# EAGLE design NullAnalyser (EAGLE 7.4.0)
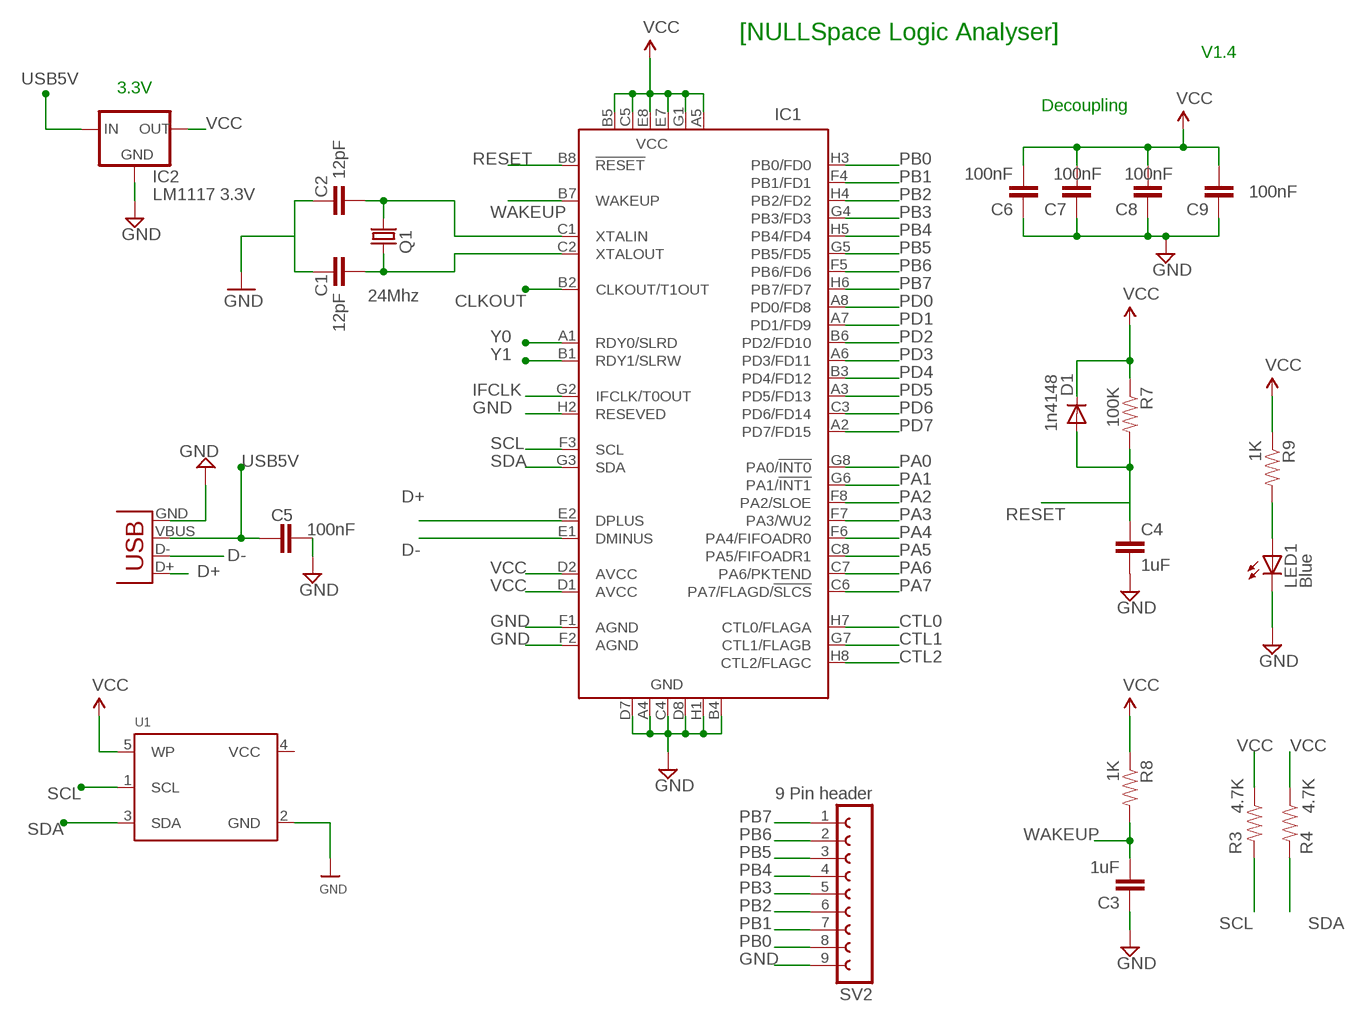
[diagram p0: schematic, sheet 1]

## Parts
C1  12pF  CAP0402-CAP  [0402-CAP]
C2  12pF  CAP0402-CAP  [0402-CAP]
C3  1uF  CAP0402-CAP  [0402-CAP]
C4  1uF  CAP0402-CAP  [0402-CAP]
C5  100nF  CAP0402-CAP  [0402-CAP]
C6  100nF  CAP0402-CAP  [0402-CAP]
C7  100nF  CAP0402-CAP  [0402-CAP]
C8  100nF  CAP0402-CAP  [0402-CAP]
C9  100nF  CAP0402-CAP  [0402-CAP]
D1  1n4148  DIODESOD  [SOD-323]
IC1  CY7C68014A-56BAXC  [VFBGA56]
IC2  LM1117 3.3V  LM1117  [SOT223]
LED1  Blue  LED0603  [LED-0603]
Q1  24Mhz  CRYSTALTWO-PADTWO-PAD  [CRYSTAL-SMD-TWO-PAD]
R3  4.7K  RESISTOR0402-RES  [0402-RES]
R4  4.7K  RESISTOR0402-RES  [0402-RES]
R7  100K  RESISTOR0402-RES  [0402-RES]
R8  1K  RESISTOR0402-RES  [0402-RES]
R9  1K  RESISTOR0402-RES  [0402-RES]
SV2  9 Pin header  FE09-1  [FE09]
U1  MCP24AA32  [SOT23-5]
X1  USB-MICROB  [USB-MICROB]

## Nets
CLKOUT: IC1.B2(CLKOUT/T1OUT)
CTL0: IC1.H7(CTL0/FLAGA)
CTL1: IC1.G7(CTL1/FLAGB)
CTL2: IC1.H8(CTL2/FLAGC)
D+: IC1.E2(DPLUS) X1.D+
D-: IC1.E1(DMINUS) X1.D-
GND: C1.1 C2.2 C3.1 C4.2 C5.2 C6.1 C7.1 C8.1 C9.1 IC1.A4(GND) IC1.B4(GND) IC1.C4(GND) IC1.D7(GND) IC1.D8(GND) IC1.F1(AGND) IC1.F2(AGND) IC1.H1(GND) IC1.H2(RESEVED) IC2.1(GND) LED1.C SV2.9 U1.2(GND) X1.GND
IFCLK: IC1.G2(IFCLK/T0OUT)
N$2: LED1.A R9.2
N$10: C2.1 IC1.C1(XTALIN) Q1.2
N$11: C1.2 IC1.C2(XTALOUT) Q1.1
PA0: IC1.G8(PA0/!INT0)
PA1: IC1.G6(PA1/!INT1)
PA2: IC1.F8(PA2/SLOE)
PA3: IC1.F7(PA3/WU2)
PA4: IC1.F6(PA4/FIFOADR0)
PA5: IC1.C8(PA5/FIFOADR1)
PA6: IC1.C7(PA6/PKTEND)
PA7: IC1.C6(PA7/FLAGD/!SLCS)
PB0: IC1.H3(PB0/FD0) SV2.8
PB1: IC1.F4(PB1/FD1) SV2.7
PB2: IC1.H4(PB2/FD2) SV2.6
PB3: IC1.G4(PB3/FD3) SV2.5
PB4: IC1.H5(PB4/FD4) SV2.4
PB5: IC1.G5(PB5/FD5) SV2.3
PB6: IC1.F5(PB6/FD6) SV2.2
PB7: IC1.H6(PB7/FD7) SV2.1
PD0: IC1.A8(PD0/FD8)
PD1: IC1.A7(PD1/FD9)
PD2: IC1.B6(PD2/FD10)
PD3: IC1.A6(PD3/FD11)
PD4: IC1.B3(PD4/FD12)
PD5: IC1.A3(PD5/FD13)
PD6: IC1.C3(PD6/FD14)
PD7: IC1.A2(PD7/FD15)
RESET: C4.1 D1.2(A) IC1.B8(!RESET) R7.2
SCL: IC1.F3(SCL) R3.2 U1.1(SCL)
SDA: IC1.G3(SDA) R4.2 U1.3(SDA)
USB5V: C5.1 IC2.3(IN) X1.VBUS
VCC [power]: C6.2 C7.2 C8.2 C9.2 D1.1(C) IC1.A5(VCC) IC1.B5(VCC) IC1.C5(VCC) IC1.D1(AVCC) IC1.D2(AVCC) IC1.E7(VCC) IC1.E8(VCC) IC1.G1(VCC) IC2.2(OUT) R3.1 R4.1 R7.1 R8.1 R9.1 U1.5(WP)
WAKEUP: C3.2 IC1.B7(WAKEUP) R8.2
Y0: IC1.A1(RDY0/SLRD)
Y1: IC1.B1(RDY1/SLRW)
Unconnected: U1.4(VCC)

## Notes on the sheet
- [NULLSpace Logic Analyser]
- V1.4
- 3.3V
- Decoupling

## Library data of the parts
C1 C2 = SparkFun:CAP: Capacitor Standard 0603 ceramic capacitor, and 0.1" leaded capacitor.; MF: KEMET; MPN: C0805C120J5GACTU; OC_NEWARK: 64K2898
C3 C4 = SparkFun:CAP: Capacitor Standard 0603 ceramic capacitor, and 0.1" leaded capacitor.; MPN: C2012Y5V1C105Z/0.85; OC_NEWARK: 90R7762
C5-C9 = SparkFun:CAP: Capacitor Standard 0603 ceramic capacitor, and 0.1" leaded capacitor.; MF: FARNELL; MPN: GRM21BR71H104KA01L; OC_NEWARK: 38K1694
D1 = SparkFun:DIODE: Diode These are standard reverse protection diodes and small signal diodes. SMA package can handle up to about 1A. SOD-323 can handle about 200mA. What the SOD-323 package when ordering, there are some mfgs out there that are 5-pin packages.; MF: VISHAY/TELEFUNKEN; MPN: 1N4148W-V-GS08; OC_NEWARK: 35K9698
IC1 = cypress:CY7C6801*A-56: EZ-USB FX2LP (TM) USB Microcontroller Source: http://www.cypress.com .. cy7c68013a_5.pdf; MPN: CY7C68014A-56BAXC; OC_FARNELL: 1269138; OC_NEWARK: 23M5564
IC2 = v-reg-3:LM1117; MF: NATIONAL SEMICONDUCTOR; MPN: LM1117MPX-3.3; OC_NEWARK: 13B5343
LED1 = SparkFun:LED: LEDs Standard schematic elements and footprints for 5mm, 3mm, 1206, and 0603 sized LEDs. 5mm - Spark Fun Electronics SKU : COM-00529 (and others); MPN: 5988210107F; OC_NEWARK: 75R0591
Q1 = NullAnalyser:CRYSTAL: Crystals Various standard crystals. Proven footprints. Spark Fun Electronics SKU : COM-00534; MF: Abracon Corporation; MPN: ABM3-24.000MHZ-B2-T; OC_NEWARK: 13J1723
R3 R4 = SparkFun:RESISTOR: Resistor Basic schematic elements and footprints for 0603, 1206, and PTH 1/10th watt (small) resistors.; MPN: CRCW08054K70JNEA; OC_NEWARK: 59M6911
R7 = SparkFun:RESISTOR: Resistor Basic schematic elements and footprints for 0603, 1206, and PTH 1/10th watt (small) resistors.; MPN: MCTF0805DTC1002; OC_NEWARK: 01P2111
R8 R9 = SparkFun:RESISTOR: Resistor Basic schematic elements and footprints for 0603, 1206, and PTH 1/10th watt (small) resistors.; MPN: MCTF0805DTC1001; OC_NEWARK: 01P2109
SV2 = con-lsta:FE09-1: FEMALE HEADER; OC_FARNELL: unknown; OC_NEWARK: unknown
U1 = microbuilder:MCP24AA32: Microchip 32K (4K x 8) 1.8V I2C EEPROM SOT23-5 [Digikey: 24AA32AFT-I/OTCT-ND]; MF: MICROCHIP; MPN: 24LC00T-I/OT; OC_NEWARK: 62K0574
X1 = SparkFun:USB: USB Connectors USB-B-PTH is fully proven SKU : PRT-00139 USB-miniB is fully proven SKU : PRT-00587 USB-A-PCB is untested. USB-A-H is throughly reviewed, but untested. Spark Fun Electronics SKU : PRT-00437 USB-B-SMT is throughly reviewed, but untested. Needs silkscreen touching up. USB-A-S has not been used/tested USB-MB-H has not been used/tested; MPN: 1734035-1; OC_NEWARK: 16M2760

## Net classes
0 default: width 0.051 mm
1 power: width 0.051 mm

## Board
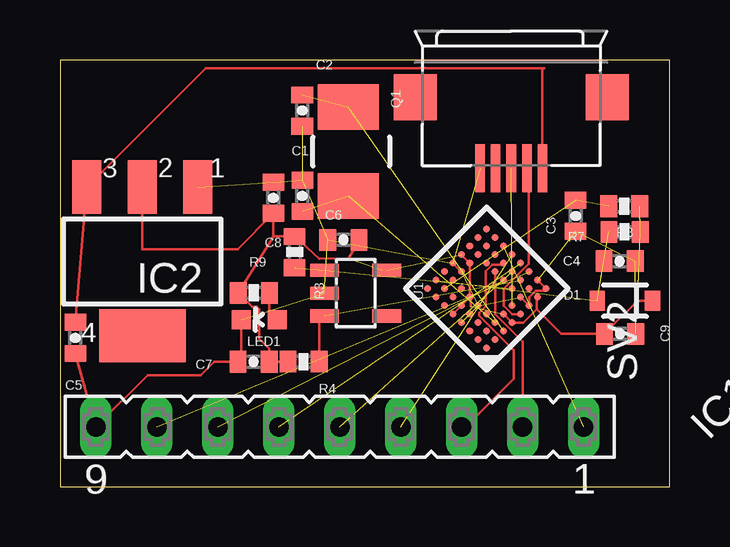
[diagram p1: board, top side]

Size 25.4 x 17.78 mm. Coordinates in mm from the lower left corner, seen from the top.
Outline: 0,0 25.4,0 25.4,17.78 0,17.78 0,0
Copper layers (1*2*16): Top 0.0356mm / dielectric 1.5011mm / Route2 0.0356mm / dielectric 0.1499mm / Bottom 0.0356mm
Design rules "SilverCircuits *": minimum track width 4mil, minimum drill 10mil, track to track 7mil, track to pad 7mil, pad to pad 7mil, via to via 7mil, smd to smd 0mil, copper to edge 20mil, drill to drill 8mil, minimum pad ring 10mil, minimum via ring 8mil, stop-mask expansion 4mil, vias tented up to drill 0mil, thermal gap 10mil
Milling: 1 lines

### Footprints (pad centres in the part's own frame; a part is rotated, then mirrored left to right if it is on the bottom)
0402-CAP = smd 0.7 x 0.9: 1 -0.65,0; 2 0.65,0
SOD-323 = smd 0.63 x 0.83: 1 -1.15,0; 2 1.15,0
VFBGA56 = smd 0.3 x 0.3: A1 -1.75,1.75; A2 -1.25,1.75; A3 -0.75,1.75; A4 -0.25,1.75; A5 0.25,1.75; A6 0.75,1.75; A7 1.25,1.75; A8 1.75,1.75; B1 -1.75,1.25; B2 -1.25,1.25; B3 -0.75,1.25; B4 -0.25,1.25; B5 0.25,1.25; B6 0.75,1.25; B7 1.25,1.25; B8 1.75,1.25; C1 -1.75,0.75; C2 -1.25,0.75; C3 -0.75,0.75; C4 -0.25,0.75; C5 0.25,0.75; C6 0.75,0.75; C7 1.25,0.75; C8 1.75,0.75; D1 -1.75,0.25; D2 -1.25,0.25; D7 1.25,0.25; D8 1.75,0.25; E1 -1.75,-0.25; E2 -1.25,-0.25; E7 1.25,-0.25; E8 1.75,-0.25; F1 -1.75,-0.75; F2 -1.25,-0.75; F3 -0.75,-0.75; F4 -0.25,-0.75; F5 0.25,-0.75; F6 0.75,-0.75; F7 1.25,-0.75; F8 1.75,-0.75; G1 -1.75,-1.25; G2 -1.25,-1.25; G3 -0.75,-1.25; G4 -0.25,-1.25; G5 0.25,-1.25; G6 0.75,-1.25; G7 1.25,-1.25; G8 1.75,-1.25; H1 -1.75,-1.75; H2 -1.25,-1.75; H3 -0.75,-1.75; H4 -0.25,-1.75; H5 0.25,-1.75; H6 0.75,-1.75; H7 1.25,-1.75; H8 1.75,-1.75
SOT223 = smd 1.219 x 2.235: 1 -2.311,-3.099; 2 0,-3.099; 3 2.311,-3.099 | smd 3.6 x 2.2: 4 0,3.099
LED-0603 = smd 0.8 x 0.8: A 0,-0.75; C 0,0.75
CRYSTAL-SMD-TWO-PAD = smd 1.9 x 2.54: 1 -1.85,0.12; 2 1.85,0.12
0402-RES = smd 0.7 x 0.9: 1 -0.65,0; 2 0.65,0
FE09 = drill 0.813 long: 1 -10.16,0; 2 -7.62,0; 3 -5.08,0; 4 -2.54,0; 5 0,0; 6 2.54,0; 7 5.08,0; 8 7.62,0; 9 10.16,0
SOT23-5 = smd 0.55 x 1.2: 1 -0.95,-1.3; 2 0,-1.3; 3 0.95,-1.3; 4 0.95,1.3; 5 -0.95,1.3
USB-MICROB = smd 0.4 x 2: D+ 0,3.1; D- -0.65,3.1; GND 1.3,3.1; ID 0.65,3.1; VBUS -1.3,3.1 | smd 1.8 x 1.9: GND@2 -4,0.15; GND@3 4,0.15

### Placement (x,y rotation side)
C1  10.1,12.12 270 top
C2  10.1,15.67 270 top
C3  21.48,11.29 90 top
C4  23.31,9.4 0 top
C5  0.64,6.2 270 top
C6  11.81,10.29 0 top
C7  8.06,5.21 0 top
C8  8.89,12.04 270 top
C9  23.34,6.37 180 top
D1  23.54,7.75 180 top
IC1  CY7C68014A-56BAXC  [VFBGA56]  17.78,8.26 135 top
IC2  3.43,9.39 180 top
LED1  8.31,6.96 90 top
Q1  12.14,13.97 90 top
R3  9.78,9.78 270 top
R4  10.15,5.21 0 top
R7  23.52,10.62 180 top
R8  23.51,11.69 180 top
R9  8.08,8.08 0 top
SV2  11.66,2.49 180 top
U1  12.32,8.06 270 top
X1  18.8,16.38 180 top

### Tracks (layer width: path | path; a pad name or v marks a point on that pad's centre or on a via)
D+  (1 unrouted)
D-
  Top 0.102: X1.D- 19.52,13.21 19.52,9.28 18.49,8.25 18.49,7.54 18.84,7.19 IC1.E1
GND  (15 unrouted)
  Top 0.102: IC1.H2 IC1.H1 20.17,8.17 19.82,8.17 19.55,7.9 IC1.F1 IC1.F2 | IC1.F2 | IC1.D8 | IC1.D8 IC1.D7 | LED1.C 7.56,5.35 C7.1 6.42,5.21 5.87,4.65 3.66,4.65 SV2.9 C5.2
N$2
  Top 0.102: LED1.A 8.73,7.29 R9.2
N$10  (2 unrouted)
N$11  (2 unrouted)
PB0  (1 unrouted)
PB1  (1 unrouted)
PB2  (1 unrouted)
PB3  (1 unrouted)
PB4  (1 unrouted)
PB5
  Top 0.102: IC1.G5 18.43,9.26 18.01,9.26 17.73,8.98 17.73,7.51 17.48,7.25 17.48,7.12 18.91,5.69 18.91,4.49 16.91,2.49 SV2.3
PB6
  Top 0.102: IC1.F5 18.13,7.18 19.28,6.04 SV2.2
PB7  (1 unrouted)
RESET  (3 unrouted)
SCL  (2 unrouted)
SDA  (1 unrouted)
  Top 0.102: U1.3 10.8,6.89 R4.2
USB5V
  Top 0.102: C5.1 IC2.3 6.07,17.44 20.18,17.44 20.1,17.36 X1.VBUS
VCC  (5 unrouted)
  Top 0.102: IC1.G1 19.86,7.86 19.86,7.39 | IC1.D1 IC1.D2 | IC1.D1 | IC1.E7 IC1.E8 | IC1.E7 | IC1.C5 IC1.E7 | IC1.B5 IC1.C5 | IC1.B5 | IC1.A5 IC1.B5 | IC1.A5 | IC1.C5 17.1,7.87 17.1,7.53 | IC1.D1 19.31,6.84 19.86,7.39 | 19.86,7.39 20.88,6.37 C9.2 24.07,7.75 D1.1 | R4.1 C7.2 8.71,5.76 8.3,6.17 8.3,7.39 8.19,7.5 8,7.5 R9.1 8.91,10.44 | 8.91,10.44 R3.1 10.8,9.51 12.03,9.53 C6.2 | U1.5 13.46,9.02 | 8.91,10.44 8.89,10.46 C8.2 7.4,9.9 3.43,9.9 IC2.2
WAKEUP  (2 unrouted)